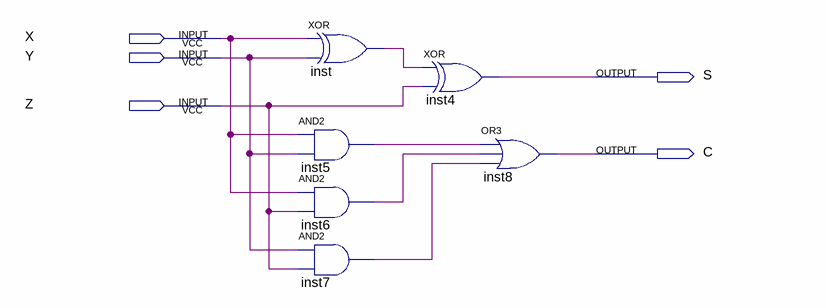
[diagram p0: schematic sheet]
// Quartus schematic FA.bdf as structural Verilog: 6 symbols, 5 pins
module FA (
  input  X,
  input  Y,
  input  Z,
  output S,
  output C
);

  wire inst5_out, inst6_out, inst7_out, inst_out;

  xor inst (inst_out, X, Y);
  and inst5 (inst5_out, X, Y);
  and inst6 (inst6_out, X, Z);
  and inst7 (inst7_out, Y, Z);
  xor inst4 (S, inst_out, Z);
  or inst8 (C, inst5_out, inst6_out, inst7_out);
endmodule
